# Altium schematic sheet SPI.SchDoc
size A4; Organization: Altium Limited; Address1: L3, 12a Rodborough Rd; Address2: Frenchs Forest; Address3: NSW; Address4: Australia 2086
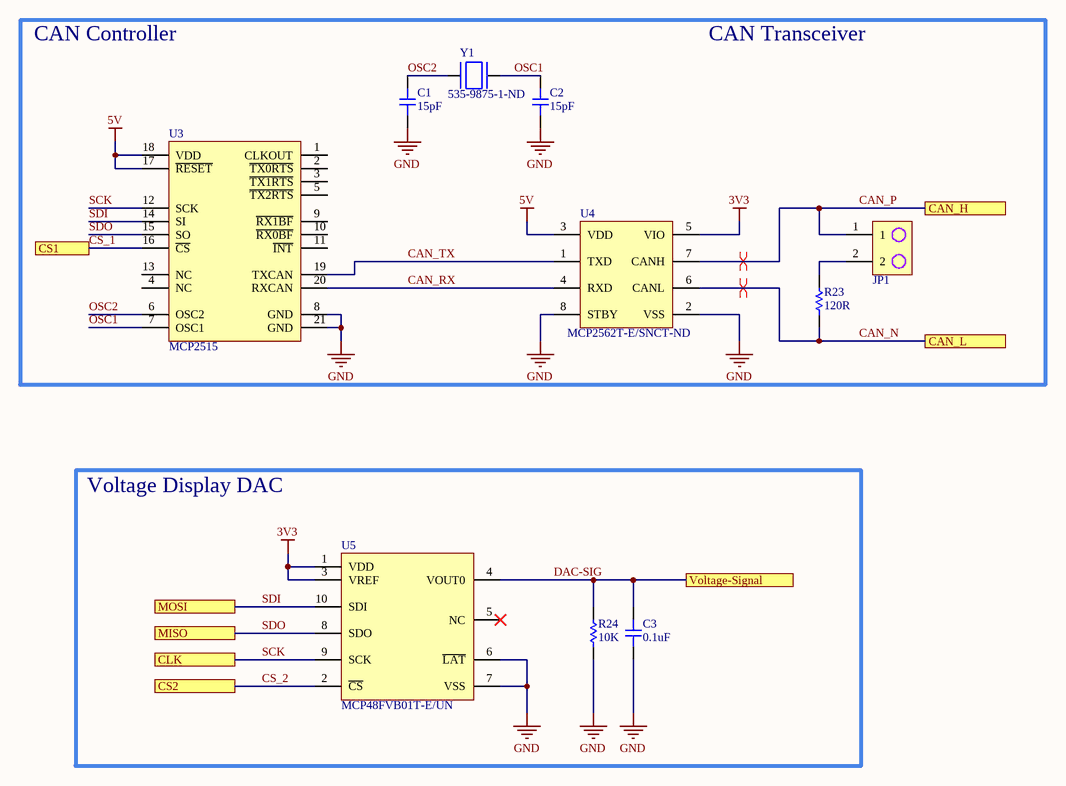
[diagram p0: SPI.SchDoc]

## Parts
C1  15pF  [CAP-0603]
C2  15pF  [CAP-0603]
C3  0.1uF  [CAP-0805]
JP1  732-5315-ND  [2PIN-JP]  (value not drawn)
R23  120R  [RES-0603]
R24  10K  [RES-0603]
U3  MCP2515  [QFN20-EP]
U4  MCP2562T-E/SNCT-ND  [8-SOIC w/o THRM]
U5  MCP48FVB01T-E/UN  [10MSOP]
Y1  535-9875-1-ND  [CRYSTAL-ABLS2]

## Blocks framed on the sheet
Voltage Display DAC: C3 R24 U5

## Ports
CAN_H, CAN_L, CLK, CS1, CS2, MISO, MOSI, Voltage-Signal

## Nets
3V3: U4.5(VIO) U5.1(VDD) U5.3(VREF)
5V: U3.17(~{RESET}) U3.18(VDD) U4.3(VDD)
GND: C1.1 C2.1 C3.1 R24.1 U3.8(GND) U3.21(GND) U4.2(VSS) U4.8(STBY) U5.6(~{LAT}) U5.7(VSS)
CAN_N: R23.1 U4.6(CANL) ; port CAN_L
CAN_P: JP1.1 U4.7(CANH) ; port CAN_H
CAN_RX: U3.20(RXCAN) U4.4(RXD)
CAN_TX: U3.19(TXCAN) U4.1(TXD)
CS_1: U3.16(~{CS}) ; port CS1
CS_2: U5.2(~{CS}) ; port CS2
DAC-SIG: C3.2 R24.2 U5.4(VOUT0) ; port Voltage-Signal
OSC1: C2.2 U3.7(OSC1) Y1.2
OSC2: C1.2 U3.6(OSC2) Y1.1
SCK: U3.12(SCK) U5.9(SCK) ; port CLK
SDI: U3.14(SI) U5.10(SDI) ; port MOSI
SDO: U3.15(SO) U5.8(SDO) ; port MISO
NetJP1_2: JP1.2 R23.2

Not connected (* = marked no-connect by the designer): U3 1(CLKOUT) 2(~{TX0RTS}) 3(~{TX1RTS}) 4(NC) 5(~{TX2RTS}) 9(~{RX1BF}) 10(~{RX0BF}) 11(~{INT}) 13(NC); U5 5(NC)*

## Layout directives
differential pair: CAN_N, CAN_P

## Notes on the sheet
- CAN Controller
- CAN Transceiver
- Title
- Size:
- Date:
- A4
- Number:
- Time:
- Revision:
- Sheet
- of
- File:

## Library data of the parts
C1 C2 = 0603-15pF-100V: CAP CER 15PF 100V C0G/NP0 0603; Manufacturer: Murata; Manufacturer Part Number: GRM1885C2A150JA01D; Material: Ceramic; Tolerance: 5%; Dielectric: C0G; Supplier 1: Digi-Key; Stock 1: 216098; Pricing 1: 1=0.12, 10=0.088, 100=0.0413, 500=0.02896, 1000=0.02397 (USD); Mount: Surface Mount; Case/Package: 0603; Case Code (Imperial): 0603; Case Code (Metric): 1608; Min Operating Temperature: -55°C; Max Operating Temperature: 125°C; Capacitance: 15pF; Packaging: Tape and Reel; Package Quantity: 1; Voltage Rating: 100V; Voltage Rating (DC): 100V; Termination: SMD/SMT; Voltage: 100V; Length: 1.6mm; Height: 0.8mm; Width: 0.8mm; Thickness: 0.035inch; Depth: 0.8mm; Radiation Hardening: No; Lead Free: Lead Free; ComponentLink1URL: http://components.arrow.com/part/dataview/40422412S9717204N2606?src-supplier=Arrow; ComponentLink1Description: http://components.arrow.com/part/dataview/40422412S9717204N2606?src-supplier=Arrow; ComponentLink2URL: http://psearch.murata.com/capacitor/product/GRM1885C2A150JA01%23.pdf?src-supplier=Avnet; ComponentLink2Description: http://psearch.murata.com/capacitor/product/GRM1885C2A150JA01%23.pdf?src-supplier=Avnet; ComponentLink3URL: http://www.mouser.com/ds/2/281/c02e-2905.pdf?src-supplier=Mouser; ComponentLink3Description: http://www.mouser.com/ds/2/281/c02e-2905.pdf?src-supplier=Mouser; ComponentLink4URL: https://www.murata.com/~/media/webrenewal/support/library/catalog/products/capacitor/mlcc/c02e.ashx?la=en-us&src-supplier=Digi-Key; ComponentLink4Description: https://www.murata.com/~/media/webrenewal/support/library/catalog/products/capacitor/mlcc/c02e.ashx?la=en-us&src-supplier=Digi-Key; ComponentLink5URL: http://search.murata.co.jp/Ceramy/image/img/A01X/partnumbering_e_01.pdf?src-supplier=Digi-Key; ComponentLink5Description: http://search.murata.co.jp/Ceramy/image/img/A01X/partnumbering_e_01.pdf?src-supplier=Digi-Key; ComponentLink6URL: https://produktinfo.conrad.com/datenblaetter/450000-474999/451247-da-01-en-VS_KONDENSATOR_0603.pdf?src-supplier=Conrad; ComponentLink6Description: https://produktinfo.conrad.com/datenblaetter/450000-474999/451247-da-01-en-VS_KONDENSATOR_0603.pdf?src-supplier=Conrad; Supplier Part Number 1: 490-1331-6-ND
C3 = C0805C104Z5VACTU: CAP CER 0.1UF 50V Y5V 0805; Manufacturer: KEMET; Dielectric Material: Ceramic; Capacitance: 100nF; Tolerance: 80%; Dissipation Factor: 5%; Supplier 1: Digi-Key; Manufacturer Part Number: C0805C104Z5VACTU; Stock 1: 929243; Pricing 1: 1=0.1, 10=0.057, 100=0.0254, 500=0.01818, 1000=0.01428 (USD); Mount: Surface Mount,PCB; Case/Package: 0805; Number of Pins: 2; Case Code (Metric): 2012; Case Code (Imperial): 0805; Min Operating Temperature: -30°C; Max Operating Temperature: 85°C; Package Quantity: 1; Voltage Rating: 50V; Packaging: Tape and Reel; Voltage Rating (DC): 50V; Dielectric: Y5V; Termination: SMD/SMT; Voltage: 50V; Length: 2mm; Height: 0.9mm; Lead Pitch: 0.75mm; Width: 0.049inch; Thickness: 0.039inch; Depth: 1.25mm; Radiation Hardening: No; REACH SVHC: No SVHC; Lead Free: Lead Free; ComponentLink1URL: http://www.alliedelec.com/m/d/9bfe7773041ffe9d406e68bc7b377fdd.pdf?src-supplier=Allied+Electronics; ComponentLink1Description: http://www.alliedelec.com/m/d/9bfe7773041ffe9d406e68bc7b377fdd.pdf?src-supplier=Allied+Electronics; ComponentLink2URL: https://www.verical.com/server-webapp/html/getDatasheet?partID=37101&src-supplier=Verical; ComponentLink2Description: https://www.verical.com/server-webapp/html/getDatasheet?partID=37101&src-supplier=Verical; ComponentLink3URL: https://www.verical.com/server-webapp/html/getDatasheet?partID=321176&src-supplier=Verical; ComponentLink3Description: https://www.verical.com/server-webapp/html/getDatasheet?partID=321176&src-supplier=Verical; ComponentLink4URL: http://www.farnell.com/datasheets/2123124.pdf?src-supplier=Element14; ComponentLink4Description: http://www.farnell.com/datasheets/2123124.pdf?src-supplier=Element14; Supplier Part Number 1: 399-1177-6-ND
JP1 = 2PIN-TEST: CONN HEADER VERT 2POS 2.54MM
R23 = 0603-120R: RES SMD 120 OHM 1% 1/10W 0603; Manufacturer: Yageo; Manufacturer Part Number: RC0603FR-07120RL; Voltage Rating (DC): 50V; Temperature Coefficient: 100ppm/°C; Power Rating: 100mW; Supplier 1: Digi-Key; Stock 1: 1047274; Pricing 1: 1=0.1, 10=0.023, 100=0.0094, 1000=0.00421, 2500=0.00366 (USD); Case/Package: 0603; Number of Pins: 2; Case Code (Metric): 1608; Case Code (Imperial): 0603; Min Operating Temperature: -55°C; Max Operating Temperature: 155°C; Resistance: 120R; Tolerance: 1%; Packaging: Tape and Reel; Composition: Thick Film; Voltage Rating: 50V; Package Quantity: 1; Number of Terminations: 2; Termination: SMD/SMT; Military Standard: Not; Max Power Dissipation: 100mW; Features: Moisture Resistant; Length: 1.6mm; Height: 0.022inch; Width: 0.031inch; Depth: 0.8mm; REACH SVHC: No SVHC; Lead Free: Lead Free; ComponentLink1URL: http://www.yageo.com/documents/recent/PYu-RC_Group_51_RoHS_L_10.pdf?src-supplier=Digi-Key; ComponentLink1Description: http://www.yageo.com/documents/recent/PYu-RC_Group_51_RoHS_L_10.pdf?src-supplier=Digi-Key; ComponentLink2URL: http://www.farnell.com/datasheets/2167052.pdf?src-supplier=Element14; ComponentLink2Description: http://www.farnell.com/datasheets/2167052.pdf?src-supplier=Element14; ComponentLink3URL: http://www.farnell.com/datasheets/1868787.pdf?src-supplier=Element14; ComponentLink3Description: http://www.farnell.com/datasheets/1868787.pdf?src-supplier=Element14; ComponentLink4URL: http://www.farnell.com/datasheets/443971.pdf?src-supplier=Element14; ComponentLink4Description: http://www.farnell.com/datasheets/443971.pdf?src-supplier=Element14; Supplier Part Number 1: 311-120HRDKR-ND
R24 = RC0603JR-0710KL: RES SMD 10K OHM 5% 1/10W 0603; Manufacturer: Yageo; Resistance: 10kR; Voltage Rating (DC): 50V; Temperature Coefficient: 100ppm/°C; Power Rating: 100mW; Supplier 1: Digi-Key; Manufacturer Part Number: RC0603JR-0710KL; Stock 1: 3006558; Pricing 1: 1=0.1, 10=0.019, 100=0.0077, 1000=0.00347, 2500=0.00301 (USD); Case/Package: 0603; Number of Pins: 2; Contact Plating: Tin,Matte; Case Code (Imperial): 0603; Case Code (Metric): 1608; Min Operating Temperature: -55°C; Max Operating Temperature: 155°C; Packaging: Tape and Reel; Tolerance: 5%; Composition: Thick Film; Voltage Rating: 50V; Termination: SMD/SMT; Military Standard: Not; Features: Moisture Resistant; Max Power Dissipation: 100mW; Number of Terminations: 2; Length: 0.063inch; Width: 0.031inch; Depth: 0.8mm; Height - Seated (Max): 0.022inch; Radiation Hardening: No; REACH SVHC: Unknown; Lead Free: Lead Free; ComponentLink1URL: http://www.yageo.com/documents/recent/PYu-RC_Group_51_RoHS_L_10.pdf?src-supplier=Digi-Key; ComponentLink1Description: http://www.yageo.com/documents/recent/PYu-RC_Group_51_RoHS_L_10.pdf?src-supplier=Digi-Key; Supplier Part Number 1: 311-10KGRDKR-ND
U3 = MCP2515-E/ML: CAN CONTROLLER, 1TX/RX, QFN-20; IC Interface Type:SPI; No. of TX Buffers:3; No. of RX Buffers:2; Supply Voltage Min:2.7V; Supply Voltage Max:5.5V; Interface Case Style:QFN; No. of Pins:20; Operating Temperature Min:-40°C; Operating ;RoHS Compliant: Yes; Manufacturer: Microchip; Interface: SPI; Operating Supply Current: 10mA; Number of Transceivers: 1; Max Supply Voltage: 5.5V; Min Supply Voltage: 2.7V; Number of Transmit Buffers: 3; Number of Receive Buffers: 2; Supplier 1: Digi-Key; Manufacturer Part Number: MCP2515-E/ML; RoHS: Yes; Category: Integrated Circuits (ICs); Stock 1: 1168; Pricing 1: 1=2.58000, 25=2.34000 (USD); Mount: Surface Mount; Case/Package: QFN; Number of Pins: 20; Min Operating Temperature: -40°C; Max Operating Temperature: 125°C; Packaging: Rail/Tube; Package Quantity: 91; Max Supply Current: 10mA; Length: 4mm; Width: 4mm; Height: 0.95mm; REACH SVHC: No SVHC; ComponentLink1URL: https://datasheet.ciiva.com/46406/1669372-46406021.pdf?src-supplier=Element14; ComponentLink1Description: https://datasheet.ciiva.com/46406/1669372-46406021.pdf?src-supplier=Element14; Supplier Part Number 1: MCP2515-E/ML-ND
U4 = CAN TRAN-MCP2562T-E/SN: IC TRANSCEIVER HALF 1/1 8SOIC; Manufacturer: Microchip; Propagation Delay: 125ns; Data Rate: 1Mbps; Nominal Supply Current: 85uA; Max Supply Voltage: 5.5V; Min Supply Voltage: 4.5V; Number of Transceivers: 1; Receiver Hysteresis: 200mV; Supplier 1: Digi-Key; Manufacturer Part Number: MCP2562T-E/SN; Stock 1: 0; Pricing 1: 1=0.9, 25=0.75, 100=0.68 (USD); Mount: Surface Mount; Case/Package: SOIC; Number of Pins: 8; Min Operating Temperature: -40°C; Max Operating Temperature: 125°C; Packaging: Tape and Reel; Package Quantity: 3300; Turn-On Delay Time: 125ns; Radiation Hardening: No; Lead Free: Lead Free; ComponentLink1URL: http://ww1.microchip.com/downloads/en/DeviceDoc/25167B.pdf?src-supplier=Digi-Key; ComponentLink1Description: http://ww1.microchip.com/downloads/en/DeviceDoc/25167B.pdf?src-supplier=Digi-Key; ComponentLink2URL: http://ww1.microchip.com/downloads/en/DeviceDoc/25167B.pdf?src-supplier=Avnet; ComponentLink2Description: http://ww1.microchip.com/downloads/en/DeviceDoc/25167B.pdf?src-supplier=Avnet; Supplier Part Number 1: MCP2562T-E/SNDKR-ND
U5 = MCP48FVB01T-E/UN: IC DAC 8BIT V-OUT 10MSOP; Manufacturer: Microchip; Number of Bits: 8; Number of D/A Converters: 1; Settling Time: 7.8us; Differential Output: No; Interface: SPI; Supplier 1: Digi-Key; Manufacturer Part Number: MCP48FVB01T-E/UN; Stock 1: 0; Pricing 1: 2500=0.585 (USD); Case/Package: MSOP; Min Operating Temperature: -40°C; Max Operating Temperature: 125°C; Packaging: Tape and Reel; RoHS Compliant: Yes; ComponentLink1URL: http://www.microchip.com/mymicrochip/filehandler.aspx?ddocname=en584450&src-supplier=Digi-Key; ComponentLink1Description: http://www.microchip.com/mymicrochip/filehandler.aspx?ddocname=en584450&src-supplier=Digi-Key; Supplier Part Number 1: MCP48FVB01T-E/UN-ND
Y1 = Crysatl-16Mhz: CRYSTAL 16.0000MHZ 18PF SMD; Manufacturer: Abracon; Manufacturer Part Number: ABLS2-16.000MHZ-D4Y-T; Frequency: 16MHz; Frequency Tolerance: 30ppm; ESR (Equivalent Series Resistance): 40R; Supplier 1: Digi-Key; Stock 1: 11099; Pricing 1: 1=0.46, 10=0.385, 50=0.3466, 100=0.308, 500=0.2926 (USD); Mount: Surface Mount; Min Operating Temperature: -40°C; Max Operating Temperature: 85°C; Package Quantity: 1000; Load Capacitance: 18pF; Packaging: Tape and Reel; Tolerance: 30ppm; Frequency Stability: 30ppm; Termination: SMD/SMT; Series Resistance: 40R; Length: 11.05mm; Height: 0.13inch; Width: 0.185inch; Depth: 4.8mm; REACH SVHC: Unknown; Lead Free: Lead Free; ComponentLink1URL: https://abracon.com/Resonators/ABLS2.pdf?src-supplier=Digi-Key; ComponentLink1Description: https://abracon.com/Resonators/ABLS2.pdf?src-supplier=Digi-Key; ComponentLink2URL: http://www.abracon.com/Resonators/ABLS2.pdf?src-supplier=Digi-Key; ComponentLink2Description: http://www.abracon.com/Resonators/ABLS2.pdf?src-supplier=Digi-Key; ComponentLink3URL: https://www.verical.com/server-webapp/html/getDatasheet?partID=719900&src-supplier=Verical; ComponentLink3Description: https://www.verical.com/server-webapp/html/getDatasheet?partID=719900&src-supplier=Verical; Supplier Part Number 1: 535-9875-6-ND